# EAGLE design SmallAmp (EAGLE 6.5.0)
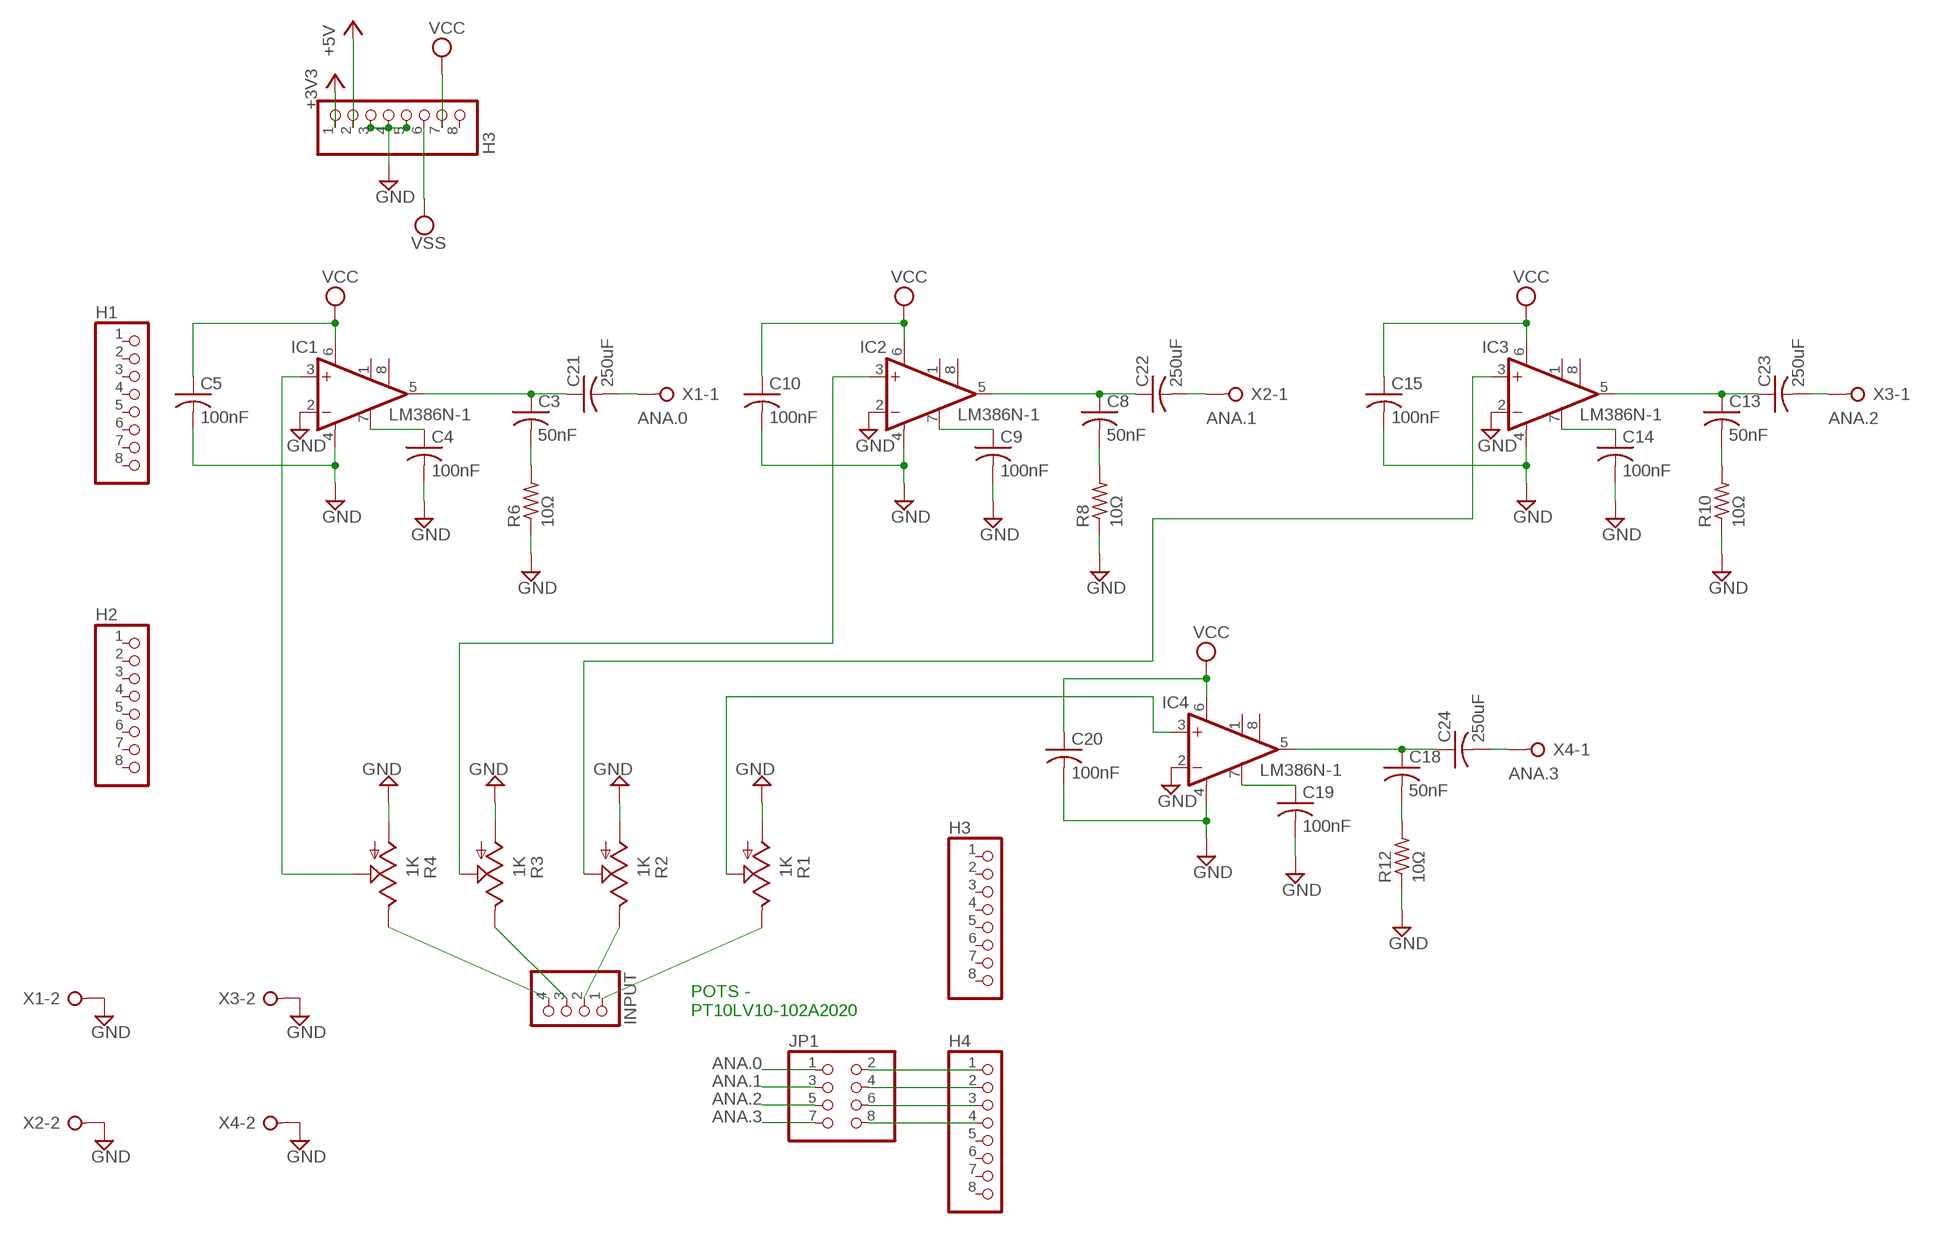
[diagram p0: schematic, sheet 1]

## Parts
C3  50nF  C-US075-032X103  [C075-032X103]
C4  100nF  C-US075-032X103  [C075-032X103]
C5  100nF  C-US075-032X103  [C075-032X103]
C8  50nF  C-US075-032X103  [C075-032X103]
C9  100nF  C-US075-032X103  [C075-032X103]
C10  100nF  C-US075-032X103  [C075-032X103]
C13  50nF  C-US075-032X103  [C075-032X103]
C14  100nF  C-US075-032X103  [C075-032X103]
C15  100nF  C-US075-032X103  [C075-032X103]
C18  50nF  C-US075-032X103  [C075-032X103]
C19  100nF  C-US075-032X103  [C075-032X103]
C20  100nF  C-US075-032X103  [C075-032X103]
C21  250uF  C-US025-050X050  [C025-050X050]
C22  250uF  C-US025-050X050  [C025-050X050]
C23  250uF  C-US025-050X050  [C025-050X050]
C24  250uF  C-US025-050X050  [C025-050X050]
H1  PINHD-1X8  [1X08]
H2  PINHD-1X8  [1X08]
H3  PINHD-1X8  [1X08]
H4  PINHD-1X8  [1X08]
IC1  LM386N-1  [DIL08]
IC2  LM386N-1  [DIL08]
IC3  LM386N-1  [DIL08]
IC4  LM386N-1  [DIL08]
INPUT  PINHD-1X4/90  [1X04/90]
JP1  PINHD-2X4  [2X04]
JP3  H3  PINHD-1X8  [1X08]
R1  1K  TRIM_US-PT-10  [PT-10]
R2  1K  TRIM_US-PT-10  [PT-10]
R3  1K  TRIM_US-PT-10  [PT-10]
R4  1K  TRIM_US-PT-10  [PT-10]
R6  10Ω  R-US_0204/7  [0204/7]
R8  10Ω  R-US_0204/7  [0204/7]
R10  10Ω  R-US_0204/7  [0204/7]
R12  10Ω  R-US_0204/7  [0204/7]
X1  W237-02P  [W237-132]
X2  W237-02P  [W237-132]
X3  W237-02P  [W237-132]
X4  W237-02P  [W237-132]

## Nets
+3V3: JP3.1
+5V: JP3.2
ANA.0: C21.2 JP1.1 X1.1
ANA.1: C22.2 JP1.3 X2.1
ANA.2: C23.2 JP1.5 X3.1
ANA.3: C24.2 JP1.7 X4.1
GND: C4.2 C5.2 C9.2 C10.2 C14.2 C15.2 C19.2 C20.2 IC1.2(-IN) IC1.4(GND) IC2.2(-IN) IC2.4(GND) IC3.2(-IN) IC3.4(GND) IC4.2(-IN) IC4.4(GND) JP3.3 JP3.4 JP3.5 R1.A R2.A R3.A R4.A R6.1 R8.1 R10.1 R12.1 X1.2 X2.2 X3.2 X4.2
N$1: INPUT.1 R1.E
N$2: INPUT.2 R2.E
N$3: INPUT.3 R3.E
N$4: INPUT.4 R4.E
N$5: IC1.3(+IN) R4.S
N$6: H4.1 JP1.2
N$7: C3.1 C21.1 IC1.5(OUT)
N$9: H4.2 JP1.4
N$10: C3.2 R6.2
N$11: C4.1 IC1.7(BYPASS)
N$12: IC2.3(+IN) R3.S
N$13: C8.1 C22.1 IC2.5(OUT)
N$15: H4.3 JP1.6
N$16: C8.2 R8.2
N$17: H4.4 JP1.8
N$18: C9.1 IC2.7(BYPASS)
N$19: IC3.3(+IN) R2.S
N$20: C13.1 C23.1 IC3.5(OUT)
N$23: C13.2 R10.2
N$25: C14.1 IC3.7(BYPASS)
N$26: IC4.3(+IN) R1.S
N$27: C18.1 C24.1 IC4.5(OUT)
N$30: C18.2 R12.2
N$32: C19.1 IC4.7(BYPASS)
VCC: C5.1 C10.1 C15.1 C20.1 IC1.6(VS) IC2.6(VS) IC3.6(VS) IC4.6(VS) JP3.7
VSS: JP3.6
Unconnected: H1.1 H1.2 H1.3 H1.4 H1.5 H1.6 H1.7 H1.8 H2.1 H2.2 H2.3 H2.4 H2.5 H2.6 H2.7 H2.8 H3.1 H3.2 H3.3 H3.4 H3.5 H3.6 H3.7 H3.8 H4.5 H4.6 H4.7 H4.8 IC1.1(GAIN) IC1.8(GAIN) IC2.1(GAIN) IC2.8(GAIN) IC3.1(GAIN) IC3.8(GAIN) IC4.1(GAIN) IC4.8(GAIN) JP3.8

## Notes on the sheet
- ANA.0 | ANA.1 | ANA.2
- ANA.3
- POTS - 
  PT10LV10-102A2020
- ANA.0
- ANA.1
- ANA.2
- ANA.3

## Library data of the parts
C3-C5 C8-C10 C13-C15 C18-C24 = resistor:C-US: CAPACITOR, American symbol
H1-H4 JP3 = pinhead:PINHD-1X8: PIN HEADER
IC1-IC4 = linear:LM386?-*: Low Voltage Audio Power Amplifier Source: http://cache.national.com/ds/LM/LM386.pdf
INPUT = pinhead:PINHD-1X4: PIN HEADER
JP1 = pinhead+:PINHD-2X4: PIN HEADER
R1-R4 = pot:TRIM_US-: POTENTIOMETER
R6 R8 R10 R12 = rcl:R-US_: RESISTOR, American symbol
X1-X4 = con-wago-508:W237-02P: WAGO SREW CLAMP; OC_FARNELL: unknown; OC_NEWARK: unknown

## Board
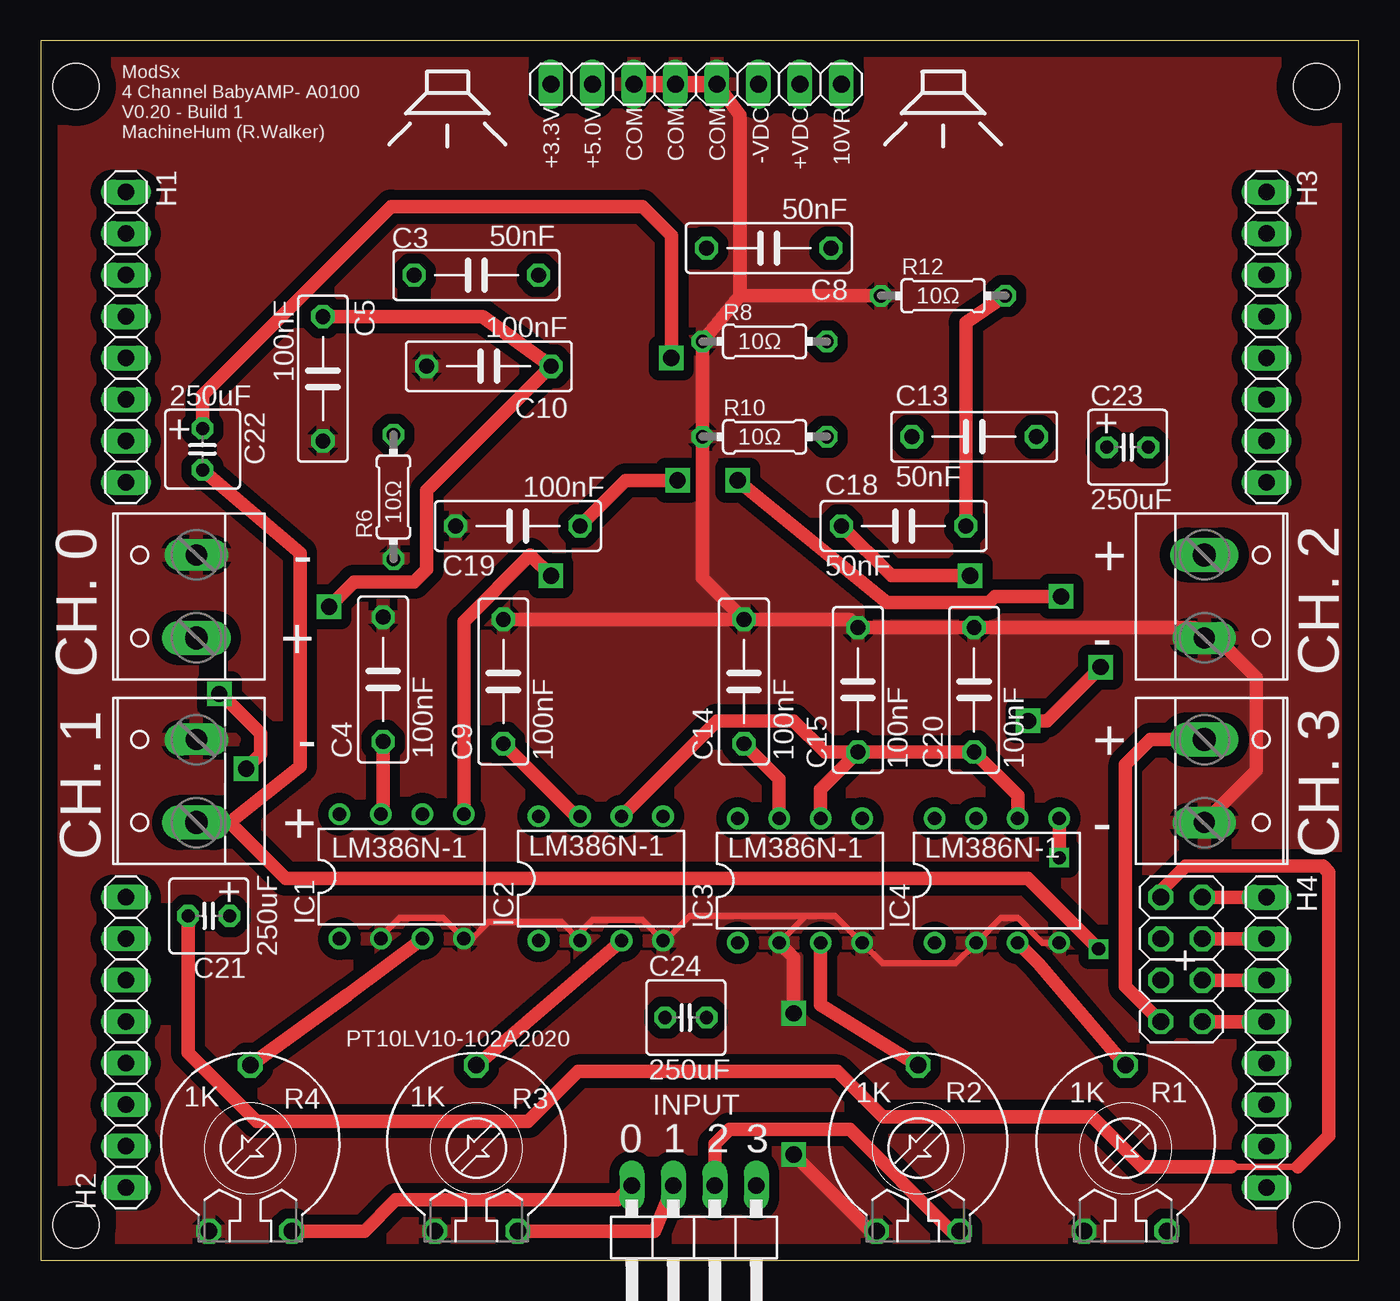
[diagram p1: board, top side]
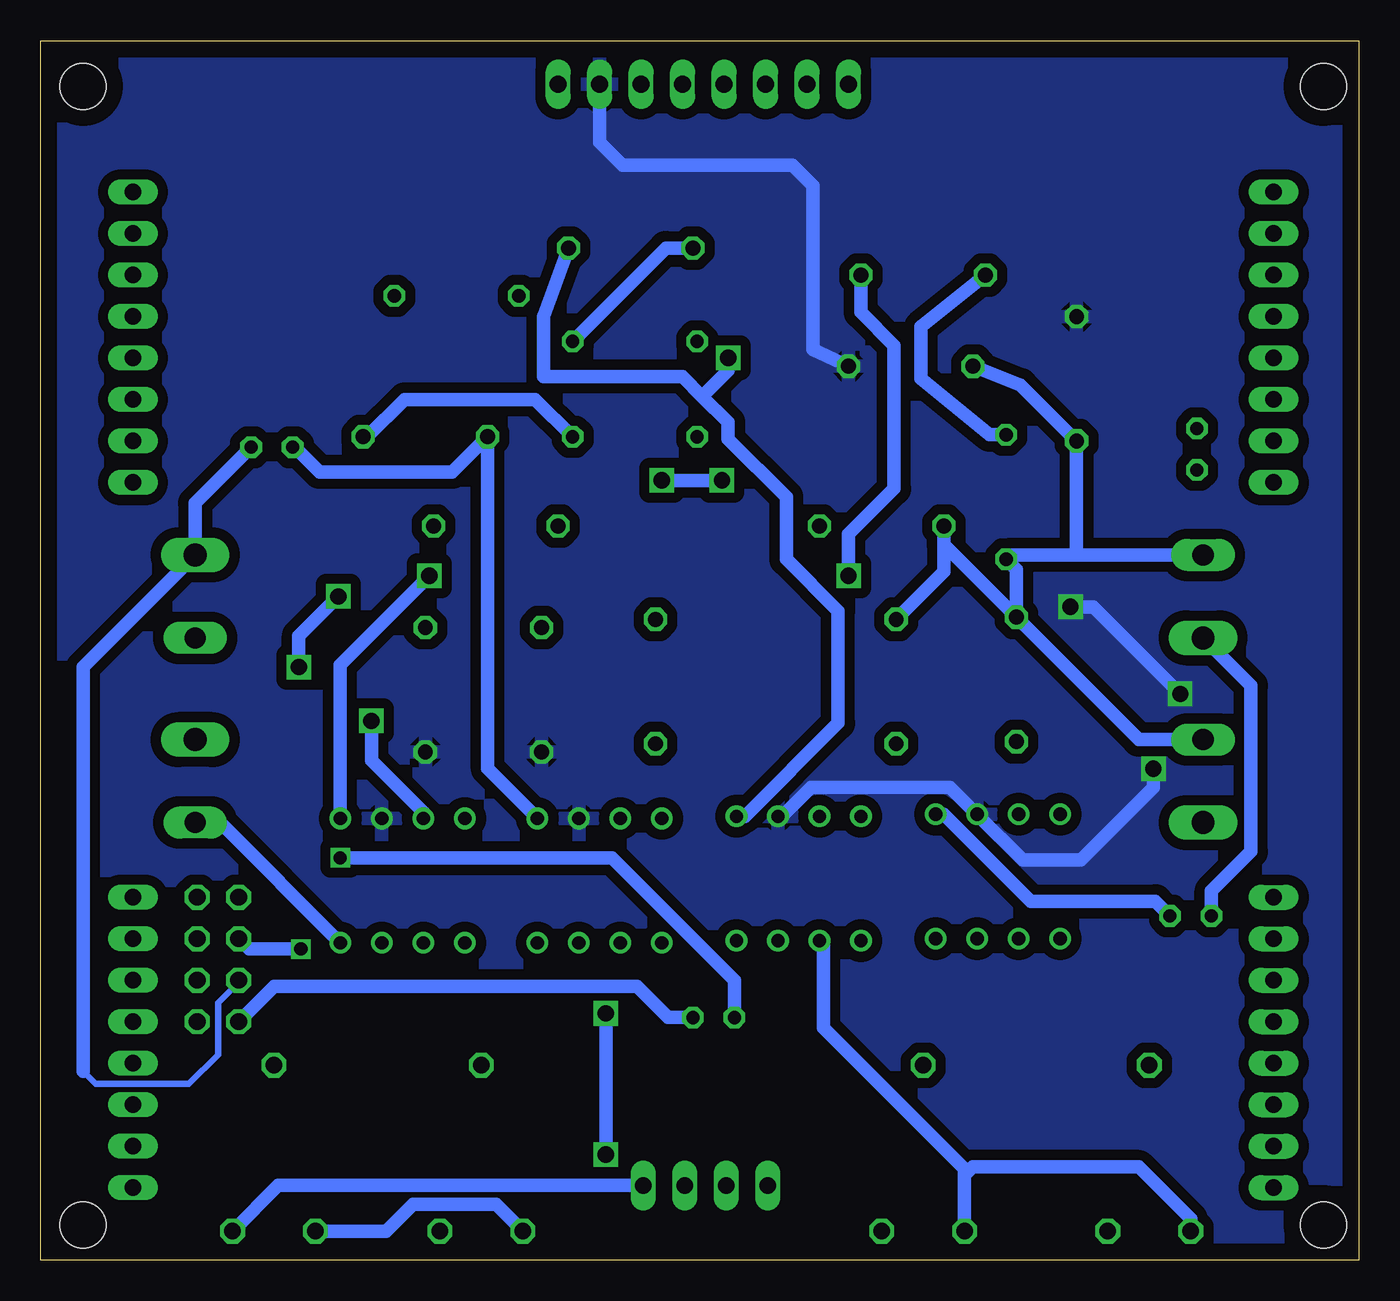
[diagram p2: board, bottom side, seen from below]

Size 80.7 x 74.67 mm. Coordinates in mm from the lower left corner, seen from the top.
Outline: 0,0 80.7,0 80.7,74.67 0,74.67 0,0
Copper layers (1*16): Top 0.035mm / dielectric 1.5mm / Bottom 0.035mm
Design rules "default": minimum track width 10mil, minimum drill 24mil, track to track 8mil, track to pad 8mil, pad to pad 8mil, via to via 8mil, smd to smd 8mil, copper to edge 40mil, drill to drill 8mil, minimum pad ring 10mil, minimum via ring 8mil, stop-mask expansion 4mil, vias tented up to drill 0mil, thermal gap 10mil
Holes 2.8 mm at 2.16,71.88 2.16,2.16 78.11,71.88 78.11,2.16

### Footprints (pad centres in the part's own frame; a part is rotated, then mirrored left to right if it is on the bottom)
C075-032X103 = drill 0.914 octagon: 1 -3.81,0; 2 3.81,0
C025-050X050 = drill 0.813 octagon: 1 -1.27,0; 2 1.27,0
1X08 = drill 1.016 long: 1 -8.89,0; 2 -6.35,0; 3 -3.81,0; 4 -1.27,0; 5 1.27,0; 6 3.81,0; 7 6.35,0; 8 8.89,0
DIL08 = drill 0.813 pad 1.27: 1 -3.81,-3.81; 2 -1.27,-3.81; 3 1.27,-3.81; 4 3.81,-3.81; 5 3.81,3.81; 6 1.27,3.81; 7 -1.27,3.81; 8 -3.81,3.81
1X04/90 = drill 1.016 long: 1 -3.81,-3.81; 2 -1.27,-3.81; 3 1.27,-3.81; 4 3.81,-3.81
2X04 = drill 1.016 octagon: 1 -3.81,-1.27; 2 -3.81,1.27; 3 -1.27,-1.27; 4 -1.27,1.27; 5 1.27,-1.27; 6 1.27,1.27; 7 3.81,-1.27; 8 3.81,1.27
PT-10 = drill 1.016 octagon: A -2.54,-5.08; E 2.54,-5.08; S 0,5.08
0204/7 = drill 0.813 octagon: 1 -3.81,0; 2 3.81,0
W237-132 = drill 1.4 long: 1 -2.54,-0.635 | drill 1.3 long: 2 2.54,-0.635

### Placement (x,y rotation side)
C3  26.67,60.33 180 top
C4  20.95,35.56 90 top
C5  17.27,53.98 270 top
C8  44.58,61.98 180 top
C9  28.32,35.43 90 top
C10  27.43,54.74 180 top
C13  57.15,50.42 0 top
C14  43.05,35.43 90 top
C15  50.04,34.92 90 top
C18  52.83,44.96 0 top
C19  29.21,44.96 180 top
C20  57.15,34.92 90 top
C21  10.29,21.08 180 top
C22  9.91,49.66 270 top
C23  66.55,49.78 0 top
C24  39.5,14.86 0 top
H1  5.21,56.52 270 top
H2  5.21,13.34 90 top
H3  75.06,56.52 270 top
H4  75.06,13.34 270 top
IC1  22.1,23.5 0 top
IC2  34.29,23.37 0 top
IC3  46.48,23.24 0 top
IC4  58.55,23.24 0 top
INPUT  40.01,0.76 180 top
JP1  69.85,18.41 270 top
JP3  40.13,72.01 0 top
R1  66.42,6.86 0 top
R2  53.72,6.86 0 top
R3  26.67,6.86 0 top
R4  12.83,6.86 0 top
R6  21.59,46.74 90 top
R8  44.32,56.26 0 top
R10  44.32,50.42 0 top
R12  55.24,59.05 0 top
X1  8.89,40.64 90 top
X2  8.89,29.34 90 top
X3  71.88,40.64 270 top
X4  71.88,29.34 270 top

### Tracks (layer width: path | path; a pad name or v marks a point on that pad's centre or on a via)
ANA.0
  Top 0.406: 76.96,5.71 72.9,5.71
  Top 0.813: JP1.1 68.58,22.61 70.1,24.13 78.49,24.13 78.87,23.75 78.87,7.62 76.96,5.71 | 72.9,5.71 67.44,5.71 64.39,8.76 51.56,8.76 48.77,11.56 32.89,11.56 29.84,8.51 13.21,8.51 9.02,12.7 C21.2
  Bottom 0.813: C21.2 9.02,22.61 6.6,25.02 6.6,35.18 X1.1
ANA.1  (via drill 0.8)
  Top 0.813: 11.56,26.8 15.88,30.23 15.88,43.31 C22.2 | X2.1 11.56,26.8 | 11.56,26.8 14.99,23.37 60.45,23.37 v64.77,19.05
  Bottom 0.813: v64.77,19.05 67.94,19.05 JP1.3
ANA.2
  Bottom 0.406: JP1.5 68.58,17.02 69.85,15.75 69.85,12.57 71.63,10.79 77.34,10.79 78.11,11.56
  Bottom 0.813: C23.2 71.25,46.35 X3.1 78.11,36.32 78.11,11.56
ANA.3
  Top 0.813: X4.1 67.94,31.88 66.42,30.35 66.42,16.76 JP1.7
  Bottom 0.813: C24.2 42.29,14.86 44.2,16.76 66.42,16.76 JP1.7
GND  (via drill 1)
  Top 0.406: IC4.4 61.34,19.43 59.82,20.95 58.8,20.95 IC4.2 56.01,18.16 51.56,18.16 IC3.4 48.64,21.08 46.86,21.08 | 46.86,21.08 IC3.2 | 46.86,21.08 39.75,21.08 38.23,19.56 IC2.4 36.83,20.83 33.78,20.83 33.02,20.07 IC2.2 31.88,20.7 27.43,20.7 26.42,19.68 IC1.4 24.64,20.95 21.97,20.95 20.83,19.81 IC1.2
  Top 0.813: X4.2 74.42,29.97 74.42,35.69 72.01,38.1 X3.2 70.61,38.73 C20.2 C15.2 49.53,39.24 C14.2 | C14.2 40.51,41.78 R10.1 R8.1 42.8,59.05 | 42.8,59.05 R12.1 | JP3.5 42.8,70.1 42.8,59.05 | C9.2 C14.2 | R2.A 50.8,1.78 v46.1,6.48 | v46.1,15.11 46.1,18.54 IC3.2
  Top 1.016: JP3.5 JP3.4 JP3.3
  Bottom 0.813: X2.2 13.46,31.88 C4.2 | X1.2 17.27,43.18 | 17.27,43.18 21.34,43.18 R6.1 20.95,42.29 C4.2 | C4.2 25.4,43.81 | 25.4,43.81 C19.2 | IC4.4 69.72,26.8 X4.2 | C10.2 20.7,53.59 C5.2 17.27,43.18 | 25.4,43.81 25.4,42.16 C9.2 | R3.A 24.13,5.21 | 24.13,5.21 24.13,5.59 32.77,14.22 32.77,19.3 IC2.2 | R4.A 10.29,2.54 13.46,5.71 23.62,5.71 24.13,5.21 | R1.A 59.56,1.78 57.91,3.43 52.83,3.43 R2.A | v46.1,6.48 v46.1,15.11
  pour Top (isolate 0.635): 0.64,0.64 0.51,74.17 80.14,74.17 80.14,0.64
N$1
  Bottom 0.813: INPUT.1 66.17,4.57 R1.E
N$2
  Top 0.813: R2.E 55.75,1.78 49.53,8 42.16,8 41.27,7.11 INPUT.2
N$3
  Top 0.813: R3.E 37.59,1.78 INPUT.3
N$4
  Top 0.813: R4.E 19.81,1.78 21.72,3.68 35.31,3.68 INPUT.4
N$5
  Top 0.813: R4.S 18.8,16.26 IC1.3
N$6
  Top 0.813: JP1.2 H4.1
N$7  (via drill 1)
  Top 0.813: IC1.5 25.91,39.12 29.97,43.18 v31.24,41.91
  Bottom 0.813: IC1.5 25.4,27.3 20.07,21.97 12.45,21.97 C21.1 | v31.24,41.91 31.24,44.45 28.45,47.24 28.45,56.01 30.48,58.04 C3.1
N$9
  Top 0.813: JP1.4 H4.2
N$10
  Bottom 0.813: R6.2 22.61,50.55 26.8,53.98 26.8,57.15 C3.2
N$11
  Top 0.406: IC1.7 20.95,27.3
  Top 0.813: 20.95,27.3 C4.1
N$12
  Top 0.813: R3.S IC2.3
N$13  (via drill 1)
  Top 0.813: C22.1 9.91,52.96 21.46,64.52 36.83,64.52 38.61,62.74 v38.61,55.24
  Bottom 0.813: C8.1 49.91,57.78 49.91,54.1 41.4,54.1 40.2,52.9 | IC2.5 37.59,27.18 31.88,32.89 31.88,39.75 35.05,42.93 35.05,46.74 38.61,50.29 38.61,51.31 40.2,52.9 | v38.61,55.24 38.61,54.48 40.2,52.9
N$15
  Top 0.813: JP1.6 H4.3
N$16
  Bottom 0.813: R8.2 42.42,61.98 C8.2
N$17
  Top 0.813: JP1.8 H4.4
N$18
  Top 0.406: IC2.7 32.77,27.18
  Top 0.813: 32.77,27.18 C9.1
N$19
  Top 0.813: R2.S 47.75,15.62 IC3.3
N$20
  Bottom 0.813: IC3.5 53.34,30.1 C13.1 55.5,48.26 63.63,48.26 65.15,49.78 C23.1
N$23
  Bottom 0.813: R10.2 50.42,52.7 58.42,52.7 60.71,50.42 C13.2
N$25
  Top 0.813: IC3.7 45.21,29.46 C14.1
N$26
  Top 0.813: R1.S 61.09,18.16 IC4.3
N$27  (via drill 0.8, 1)
  Top 0.813: v62.36,24.64 IC4.5 | v56.9,41.91 52.07,41.91 C18.1
  Bottom 0.813: IC4.5 62.36,36.45 v56.9,41.91 | C24.1 38.23,17.14 45.72,24.64 v62.36,24.64
N$30
  Top 0.813: R12.2 56.64,57.4 C18.2
N$32  (via drill 1)
  Top 0.813: v60.45,33.02 61.59,33.02 v64.9,36.32 | v62.48,40.64 58.42,40.64 58.04,40.26 51.82,40.26 v42.67,47.75 | v38.99,47.75 35.81,47.75 C19.1
  Bottom 0.813: IC4.7 57.28,27.43 60.45,30.61 v60.45,33.02 | v64.9,36.32 64.9,38.23 v62.48,40.64 | v42.67,47.75 v38.99,47.75
VCC  (via drill 1)
  Top 0.813: IC3.6 47.75,28.83 C15.1 | IC4.6 59.82,28.45 C20.1 C15.1 | IC2.6 41.4,33.02 46.1,33.02 48.01,31.11 C15.1 | C5.1 27.05,57.78 C10.1 23.62,47.12 23.62,42.29 22.86,41.53 19.18,41.53 v17.65,40.01 | v10.92,34.67 11.05,34.67 13.46,32.26 13.46,30.99 v12.57,30.1
  Bottom 0.813: IC2.6 35.31,27.18 33.53,28.96 25.02,28.96 IC1.6 20.57,24.51 17.02,24.51 12.57,28.96 v12.57,30.1 | C10.1 33.4,55.75 33.4,65.79 34.67,67.06 45.09,67.06 46.48,68.45 JP3.7 | v17.65,40.01 16.26,40.01 v10.92,34.67
  pour Bottom (isolate 0.635): 0.51,74.17 0.51,73.41 0.64,0.64 80.14,0.64 80.14,74.17

### Text on the board
tPlace: +3.3V | +5.0V | COM | COM | COM | -VDC | +VDC | 10VR | ModSx / 4 Channel BabyAMP- A0100 / V0.20 - Build 1 / MachineHum (R.Walker) | + | + | - | + | + | - | CH. 0 | CH. 2 | - | + | + | - | CH. 1 | CH. 3 | + | + | PT10LV10-102A2020 | 0 | 1 | 2 | 3